# Altium schematic sheet DC_DC.SchDoc
size A4
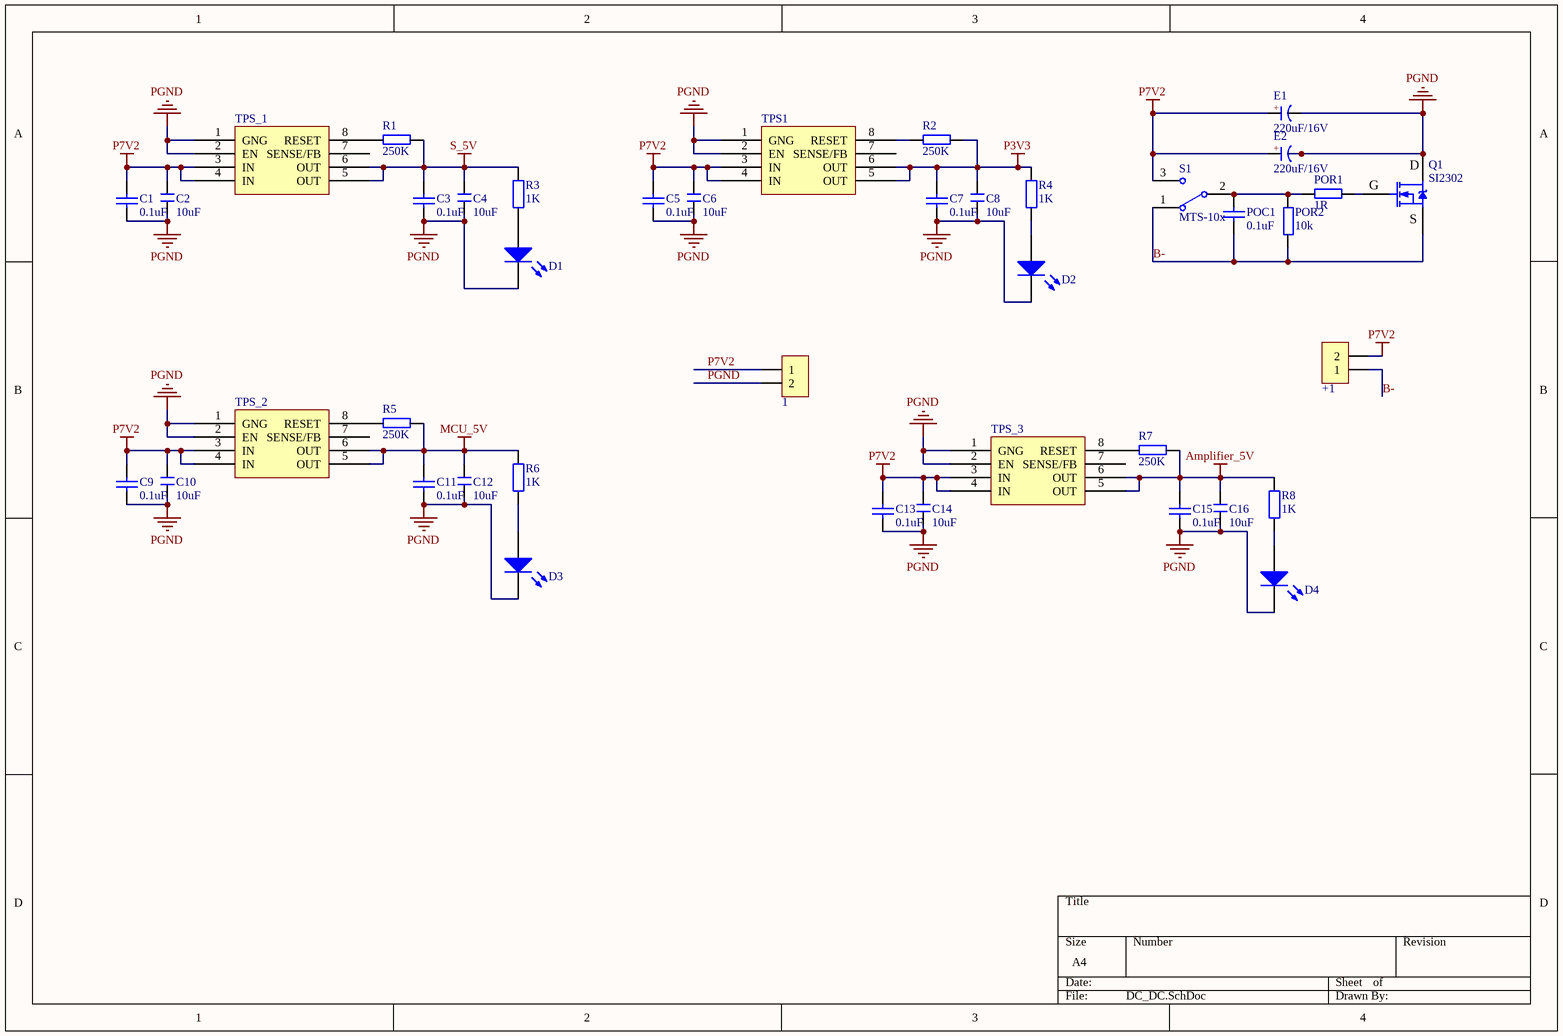
[diagram p0: DC_DC.SchDoc]

## Parts
1  HDR-1X2  [KF301-5.0-2P]  (value not drawn)
+1  HDR-1X2  [电源入口]  (value not drawn)
C1  0.1uF  [C 0603_L]
C2  10uF  [C 0805_L]
C3  0.1uF  [C 0603_L]
C4  10uF  [C 0805_L]
C5  0.1uF  [C 0603_L]
C6  10uF  [C 0805_L]
C7  0.1uF  [C 0603_L]
C8  10uF  [C 0805_L]
C9  0.1uF  [C 0603_L]
C10  10uF  [C 0805_L]
C11  0.1uF  [C 0603_L]
C12  10uF  [C 0805_L]
C13  0.1uF  [C 0603_L]
C14  10uF  [C 0805_L]
C15  0.1uF  [C 0603_L]
C16  10uF  [C 0805_L]
D1  LED  [LED 0603B]  (value not drawn)
D2  LED  [LED 0603B]  (value not drawn)
D3  LED  [LED 0603B]  (value not drawn)
D4  LED  [LED 0603B]  (value not drawn)
E1  220uF/16V  [CM D(6.3*7.7)]
E2  220uF/16V  [CM D(6.3*7.7)]
POC1  0.1uF  [C 0603_L]
POR1  1R  [R 0603_L]
POR2  10k  [C 0603_L]
Q1  SI2302  [TO252 - 3]
R1  250K  [R 0603_L]
R2  250K  [R 0603_L]
R3  1K  [R 0603_L]
R4  1K  [R 0603_L]
R5  250K  [R 0603_L]
R6  1K  [R 0603_L]
R7  250K  [R 0603_L]
R8  1K  [R 0603_L]
S1  MTS-10x  [MTS-10x]
TPS1  UUUUUU  [SOP-8]  (value not drawn)
TPS_1  UUUUUU  [SOP8]  (value not drawn)
TPS_2  UUUUUU  [SOP8]  (value not drawn)
TPS_3  UUUUUU  [SOP8]  (value not drawn)

## Nets
Amplifier_5V: C15.2 C16.2 R7.1 R8.2 TPS_3.5(OUT) TPS_3.6(OUT)
MCU_5V: C11.2 C12.2 R5.1 R6.2 TPS_2.5(OUT) TPS_2.6(OUT)
P3V3: C7.2 C8.2 R2.1 R4.2 TPS1.5(OUT) TPS1.6(OUT)
P7V2: 1.1 +1.2 C1.2 C2.2 C5.2 C6.2 C9.2 C10.2 C13.2 C14.2 E1.1(A) E2.1(A) S1.3 TPS1.3(IN) TPS1.4(IN) TPS_1.3(IN) TPS_1.4(IN) TPS_2.3(IN) TPS_2.4(IN) TPS_3.3(IN) TPS_3.4(IN)
PGND: 1.2 C1.1 C2.1 C3.1 C4.1 C5.1 C6.1 C7.1 C8.1 C9.1 C10.1 C11.1 C12.1 C13.1 C14.1 C15.1 C16.1 D1.2(K) D2.2(K) D3.2(K) D4.2(K) E1.2(K) E2.2(K) Q1.3(D) TPS1.1(GNG) TPS1.2(EN) TPS_1.1(GNG) TPS_1.2(EN) TPS_2.1(GNG) TPS_2.2(EN) TPS_3.1(GNG) TPS_3.2(EN)
S_5V: C3.2 C4.2 R1.1 R3.2 TPS_1.5(OUT) TPS_1.6(OUT)
B-: +1.1 POC1.1 POR2.1 Q1.2(S) S1.1
NetD1_1: D1.1(A) R3.1
NetD2_1: D2.1(A) R4.1
NetD3_1: D3.1(A) R6.1
NetD4_1: D4.1(A) R8.1
NetPOC1_2: POC1.2 POR1.2 POR2.2 S1.2
NetPOR1_1: POR1.1 Q1.1(G)
NetR1_2: R1.2 TPS_1.8(RESET)
NetR2_2: R2.2 TPS1.8(RESET)
NetR5_2: R5.2 TPS_2.8(RESET)
NetR7_2: R7.2 TPS_3.8(RESET)

Not connected (* = marked no-connect by the designer): TPS1 7(SENSE/FB); TPS_1 7(SENSE/FB); TPS_2 7(SENSE/FB); TPS_3 7(SENSE/FB)

## Notes on the sheet
- (in symbol CE_SMD) +

## Library data of the parts
1 = Header 2: 2P接插件; 版权归属: 封装库来自淘宝 ID：黄晶宝石; 优秀评价可免费更新封装库: 联系淘宝ID：黄晶宝石，获取更新版封装库; 卖家免费技术支持，联系售后: 唯一出售店铺网址https://shop463601444.taobao.com; 封装库来自淘宝卖家 ID：黄晶宝石: 其他店铺购入均为盗版，请立即申请退款; BOM名称: 2P接插件
+1 = Header 2: 2P接插件; pin to pad: 1>2 2>1; 版权归属: 封装库来自淘宝 ID：黄晶宝石; 优秀评价可免费更新封装库: 联系淘宝ID：黄晶宝石，获取更新版封装库; 卖家免费技术支持，联系售后: 唯一出售店铺网址https://shop463601444.taobao.com; 封装库来自淘宝卖家 ID：黄晶宝石: 其他店铺购入均为盗版，请立即申请退款; BOM名称: 2P接插件
C1 C3 C5 C7 C9 C11 C13 C15 POC1 = Cap Semi: Capacitor (Semiconductor SIM Model); Published: 8-Jun-2000; LatestRevisionDate: 29-May-2009; LatestRevisionNote: IPC-7351 Footprint Added.; PackageReference: C1206; Publisher: Altium Limited; PackageDescription: Chip Capacitor; Value: 0.1uF
C2 C4 C6 C8 C10 C12 C14 C16 = C: 贴片电容; BOM名称: 无极性贴片电容; 封装库来自淘宝卖家 ID：黄晶宝石: 其他店铺购入均为盗版假冒封装库; 联系卖家，免费查找封装: 唯一出售店铺网址https://shop463601444.taobao.com
D1-D4 = LED: 发光二极管; 封装库来自淘宝卖家 ID：黄晶宝石: 其他店铺购入均为假冒，请立即申请退款，本店奖励2~5元现金; 卖家免费查找封装，联系售后: 唯一出售店铺网址https://shop463601444.taobao.com
E1 E2 = CE_SMD: 贴片电解电容; 封装库来自淘宝卖家 ID：黄晶宝石: 其他店铺购入均为盗版假冒封装库; 联系卖家，免费查找封装: 唯一出售店铺网址https://shop463601444.taobao.com; BOM名称: 贴片电解电容
POR1 POR2 R1 R2 R5 R7 = R
Q1 = SI2302: N沟道场效应管; pin to pad: 2>3 3>2; 封装库来自淘宝卖家 ID：黄晶宝石: 其他店铺购入均为假冒，请申请退款，本店现金奖励; 卖家免费查找封装，联系售后: 唯一出售店铺网址https://shop463601444.taobao.com; BOM名称: N沟道场效应管
R3 R4 R6 R8 = R: 贴片电阻; 封装库来自淘宝卖家 ID：黄晶宝石: 其他店铺购入均为盗版假冒封装库; 联系卖家，免费查找封装: 唯一出售店铺网址https://shop463601444.taobao.com; BOM名称: 贴片电阻
S1 = MTS-10x: MTS10x系列3脚扭子开关; 免费技术支持，联系售后: 唯一出售店铺网址https://shop463601444.taobao.com; 封装库来自淘宝卖家 ID：黄晶宝石: 其他店铺购入均为盗版假冒封装库，请立即申请退款，本店3~10元现金奖励; BOM名称: MTS10x系列3脚扭子开关
TPS1 TPS_1-TPS_3 = TPS7333